# Altium schematic sheet MUX.SchDoc: AUDIO-MUX
size A4; SheetNumber: 3; SheetTotal: 3; DOC_NO_SCH_DWG: #0112023010802
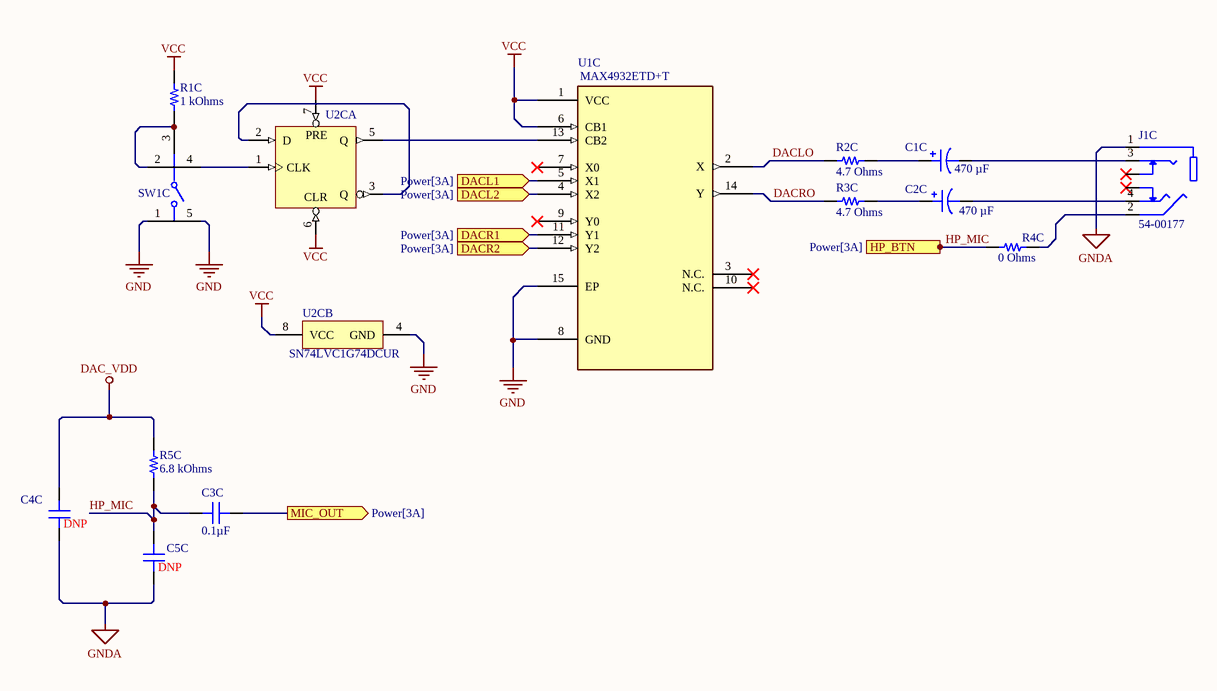
[diagram p0: MUX.SchDoc]

## Parts
C1C  470 µF  [CAP ALSMD POLY 8.3MM H10.0MM]
C2C  470 µF  [CAP ALSMD POLY 8.3MM H10.0MM]
C3C  0.1µF  [CAP 0603_1608]
C4C  DNP  [CAP 0603_1608]
C5C  DNP  [CAP 0603_1608]
J1C  54-00177  [TENSILITY_54-00177]
R1C  1 kOhms  [RES 0603_1608]
R2C  4.7 Ohms  [RES 0603_1608]
R3C  4.7 Ohms  [RES 0603_1608]
R4C  0 Ohms  [RES 0402_1005]
R5C  6.8 kOhms  [RES 0603_1608]
SW1C  KMS231GPLFS  [FP-KMS231GPLFS-MFG]  (value not drawn)
U1C  MAX4932ETD+T  [21-0137_T1433+2_MXM]  (value not drawn)
U2C  SN74LVC1G74DCUR  [DCU0008A_L]  (value not drawn)  (parts A,B of 2)

## Ports
DACL1 (in, see Power[3A]), DACL2 (in, see Power[3A]), DACR1 (in, see Power[3A]), DACR2 (in, see Power[3A]), HP_BTN (out, see Power[3A]), MIC_OUT (out, see Power[3A])

## Nets
DAC_VDD: C4C.1 R5C.2
GND: SW1C.1 SW1C.5 U1C.8(GND) U1C.15(EP) U2C.4(GND)
GNDA: C4C.2 C5C.2 J1C.1
VCC: R1C.2 U1C.1(VCC) U1C.6(CB1) U2C.6(~{CLR}) U2C.7(~{PRE}) U2C.8(VCC)
DACL1: U1C.5(X1) ; port DACL1
DACL2: U1C.4(X2) ; port DACL2
DACLO: R2C.1 U1C.2(X)
DACR1: U1C.11(Y1) ; port DACR1
DACR2: U1C.12(Y2) ; port DACR2
DACRO: R3C.1 U1C.14(Y)
HP_MIC: C3C.2 C5C.1 R4C.1 R5C.1 ; port HP_BTN
MIC_OUT: C3C.1 ; port MIC_OUT
NetC1C_1: C1C.1 R2C.2
NetC1C_2: C1C.2 J1C.3
NetC2C_1: C2C.1 R3C.2
NetC2C_2: C2C.2 J1C.4
NetJ1C_2: J1C.2 R4C.2
NetR1C_1: R1C.1 SW1C.2 SW1C.3
NetSW1C_4: SW1C.4 U2C.1(CLK)
NetU1C_13: U1C.13(CB2) U2C.5(Q)
NetU2C_2: U2C.2(D) U2C.3(Q)

Not connected (* = marked no-connect by the designer): J1C 5* 6*; U1C 3(N.C.)* 7(X0)* 9(Y0)* 10(N.C.)*

## Notes on the sheet
- THIS DOCUMENT AND THE DATA DISCLOSED HEREIN OR
- HEREWITH IS THE PROPERTY OF SPD Ind.
- ENG:
- DHARAGESWARAN S
- APPROVALS
- DATE
- PROJECT
- DSN:
- CHK:
- REFERENCE DOCUMENTS
- PROJECT REVISION:
- TITLE
- DOCUMENT REVISION:
- Email: sdhamuvkl@gmail.com <https://github.com/DhamuVkl>
- BOM:
- FAB DWG:
- PCB DWG:
- ASSY DWG:
- SCALE:
- A4
- SIZE
- CAGE CODE
- FILE NAME
- DWG NO.
- SHEET
- REV
- OF
- (in symbol CMP-0859-00701-3, part A) PRE; CLR

## Library data of the parts
C1C C2C = SVZ1AM471F9RE00RAXXX: POLYMER ALUMINUM SMT; Manufacturer: Aishi Capacitors (Hunan Aihua Group; id: 968; Surface Mount Land Size: 0.327" L x 0.327" W (8.30mm x 8.30mm); Tolerance: ±20%; Voltage - Rated: 10 V; Lifetime @ Temp.: 2000 Hrs @ 105°C; Ripple Current @ High Frequency: 3.4 A @ 100 kHz; Esr (Equivalent Series Resistance): 22mOhm; Part Number: SVZ1AM471F9RE00RAXXX; Value: 470 µF; Height - Seated (Max): 0.394" (10.00mm); Supplier Part Number 1: 3222-SVZ1AM471F9RE00RAXXXCT-ND; ComponentLink2Description: DigiKey Link; PartId: 5392; Supplier 1: DigiKey; Series: VZ; LastUpdated: 2023-01-02T21:05:51.287; Part Status: Active; Type: Polymer; Capacitance: 470 µF; Minimum Order: 1; Packaging: TapeAndReel; Applications: General Purpose; Price: 0.22; ComponentLink2URL: https://www.digikey.com/en/products/detail/aishi-capacitors/SVZ1AM471F9RE00RAXXX/16536381; Lifecycle Status: Active; Operating Temperature: -55°C ~ 105°C; Size / Dimension: 0.315" Dia (8.00mm); Mounting Type: Surface Mount
C3C = LD03ZC104KAB2A: CAP CER 0.1UF 10V X7R 0603; Manufacturer: AVX Corporation; id: 3762; Tolerance: ±10%; Part Number: LD03ZC104KAB2A; Value: 0.1µF; Temperature Coefficient: X7R; Supplier Part Number 1: 478-12926-1-ND; ComponentLink2Description: DigiKey Link; ComponentLink1URL: http://datasheets.avx.com/LD-Series.pdf; PartId: 16481; Supplier 1: DigiKey; Series: LD; LastUpdated: 2020-09-02T01:03:06.140; Part Status: Active; Capacitance: 0.1µF; Device Package: 0603 (1608 Metric); Thickness (Max): 0.035" (0.90mm); Voltage - Rated: 10V; Minimum Order: 1; Packaging: TapeAndReel; Applications: General Purpose; Package / Case: 0603 (1608 Metric); ComponentLink1Description: Datasheet; Price: 0.17; ComponentLink2URL: http://digikey.com/product-detail/en/avx-corporation/LD03ZC104KAB2A/478-12926-1-ND/9949296; Lifecycle Status: Active; Operating Temperature: -55°C ~ 125°C; Size / Dimension: 0.063" L x 0.032" W (1.60mm x 0.81mm); Mounting Type: Surface Mount, MLCC
C4C C5C = LD03ZC104KAB2A: CAP CER 0.1UF 10V X7R 0603; Manufacturer: AVX Corporation; id: 3762; Value: 0.1µF; Tolerance: ±10%; Part Number: LD03ZC104KAB2A; Temperature Coefficient: X7R; Supplier Part Number 1: 478-12926-1-ND; ComponentLink2Description: DigiKey Link; ComponentLink1URL: http://datasheets.avx.com/LD-Series.pdf; PartId: 16481; Supplier 1: DigiKey; Series: LD; LastUpdated: 2020-09-02T01:03:06.140; Part Status: Active; Capacitance: 0.1µF; Device Package: 0603 (1608 Metric); Thickness (Max): 0.035" (0.90mm); Voltage - Rated: 10V; Minimum Order: 1; Packaging: TapeAndReel; Applications: General Purpose; Package / Case: 0603 (1608 Metric); ComponentLink1Description: Datasheet; Price: 0.17; ComponentLink2URL: http://digikey.com/product-detail/en/avx-corporation/LD03ZC104KAB2A/478-12926-1-ND/9949296; Lifecycle Status: Active; Operating Temperature: -55°C ~ 125°C; Size / Dimension: 0.063" L x 0.032" W (1.60mm x 0.81mm); Mounting Type: Surface Mount, MLCC
J1C = 54-00177: Connector, 4C audio jack, 3.5xL14 mm, SMT mount, gold plated; MF: Tensility International Corp; Package: None; Price: None; Check_prices: https://www.snapeda.com/parts/54-00177/Tensility+International+Corp/view-part/?ref=eda; Value: *; SnapEDA_Link: https://www.snapeda.com/parts/54-00177/Tensility+International+Corp/view-part/?ref=snap; MP: 54-00177; Availability: In Stock; Purchase-URL: https://pricing.snapeda.com/search?q=54-00177&ref=eda
R1C = RT0603FRE131KL: CHIP RESISTOR THIN FLIM HIGH PRE; Manufacturer: Yageo; id: 16662; Temperature Coefficient: ±50ppm/°C; Tolerance: ±1%; Power (Watts): 0.1W, 1/10W; Part Number: RT0603FRE131KL; Height - Seated (Max): 0.022" (0.55mm); Supplier Part Number 1: 13-RT0603FRE131KLCT-ND; Supplier Device Package: 0603; ComponentLink1Description: Datasheet; ComponentLink2URL: https://www.digikey.com/en/products/detail/yageo/RT0603FRE131KL/14008371; ComponentLink1URL: https://www.yageo.com/upload/media/product/productsearch/datasheet/rchip/PYu-RT_1-to-0.01_RoHS_L_12.pdf; Composition: Thin Film; Supplier 1: DigiKey; Series: RT; Part Status: Active; ComponentLink2Description: DigiKey Link; Device Package: 0603 (1608 Metric); Packaging: TapeAndReel; Minimum Order: 1; Package / Case: 0603 (1608 Metric); PartId: 67562; Lifecycle Status: Active; LastUpdated: 2023-01-02T20:27:55.493; Operating Temperature: -55°C ~ 155°C; Number Of Terminations: 2; Value: 1 kOhms; Size / Dimension: 0.063" L x 0.031" W (1.60mm x 0.80mm); Price: 0.01; Resistance: 1 kOhms
R2C R3C = SG73P1JTTD4R70F: RES 4.7 OHM 1% 1/3W 0603; Manufacturer: KOA Speer Electronics, Inc.; id: 16524; Temperature Coefficient: ±100ppm/°C; Power (Watts): 0.333W, 1/3W; Part Number: SG73P1JTTD4R70F; Height - Seated (Max): 0.022" (0.55mm); Supplier Part Number 1: 2019-SG73P1JTTD4R70FCT-ND; Supplier Device Package: 0603; ComponentLink1Description: Datasheet; ComponentLink2URL: https://www.digikey.com/en/products/detail/koa-speer-electronics-inc/SG73P1JTTD4R70F/10188387; Features: Automotive AEC-Q200, Pulse Withstanding; ComponentLink1URL: https://www.koaspeer.com/pdfs/SG73P.pdf; Composition: Thick Film; Tolerance: ±1%; Supplier 1: DigiKey; Series: SG73P; Part Status: Active; ComponentLink2Description: DigiKey Link; Device Package: 0603 (1608 Metric); Packaging: TapeAndReel; Ratings: AEC-Q200; Minimum Order: 1; Package / Case: 0603 (1608 Metric); PartId: 66982; Lifecycle Status: Active; LastUpdated: 2023-01-02T20:27:57.163; Operating Temperature: -55°C ~ 155°C; Number Of Terminations: 2; Value: 4.7 Ohms; Size / Dimension: 0.063" L x 0.031" W (1.60mm x 0.80mm); Price: 0.01; Resistance: 4.7 Ohms
R4C = AC0402JR-070RL: RES SMD 0 OHM JUMPER 1/16W 0402; Manufacturer: Yageo; id: 9339; Power (Watts): 0.063W, 1/16W; Part Number: AC0402JR-070RL; Height - Seated (Max): 0.015" (0.37mm); Supplier Part Number 1: 311-0.0LBCT-ND; Supplier Device Package: 0402; ComponentLink1Description: Datasheet; ComponentLink2URL: https://www.digikey.com/en/products/detail/yageo/AC0402JR-070RL/2827807; Features: Automotive AEC-Q200, Moisture Resistant; ComponentLink1URL: https://www.yageo.com/upload/media/product/productsearch/datasheet/rchip/PYu-AC_51_RoHS_L_7.pdf; Composition: Thick Film; Tolerance: Jumper; Supplier 1: DigiKey; Series: AC; Part Status: Active; ComponentLink2Description: DigiKey Link; Device Package: 0402 (1005 Metric); Packaging: CutTape; Ratings: AEC-Q200; Minimum Order: 1; Package / Case: 0402 (1005 Metric); PartId: 20617; Lifecycle Status: Active; LastUpdated: 2023-01-02T20:20:32.243; Operating Temperature: -55°C ~ 155°C; Number Of Terminations: 2; Value: 0 Ohms; Size / Dimension: 0.039" L x 0.020" W (1.00mm x 0.50mm); Price: 0.01; Resistance: 0 Ohms
R5C = ERA-3AEB682V: RES SMD 6.8K OHM 0.1% 1/10W 0603; Manufacturer: Panasonic Electronic Components; id: 311; Temperature Coefficient: ±25ppm/°C; Power (Watts): 0.1W, 1/10W; Part Number: ERA-3AEB682V; Height - Seated (Max): 0.022" (0.55mm); Supplier Part Number 1: P6.8KDBCT-ND; Supplier Device Package: 0603; ComponentLink1Description: Datasheet; ComponentLink2URL: https://www.digikey.com/en/products/detail/panasonic-electronic-components/ERA-3AEB682V/1465874; Features: Automotive AEC-Q200; ComponentLink1URL: https://industrial.panasonic.com/cdbs/www-data/pdf/RDM0000/AOA0000C307.pdf; Composition: Thin Film; Tolerance: ±0.1%; Supplier 1: DigiKey; Series: ERA-3A; Part Status: Active; ComponentLink2Description: DigiKey Link; Device Package: 0603 (1608 Metric); Packaging: TapeAndReel; Ratings: AEC-Q200; Minimum Order: 1; Package / Case: 0603 (1608 Metric); PartId: 5530; Lifecycle Status: Active; LastUpdated: 2023-01-02T20:30:24.413; Operating Temperature: -55°C ~ 155°C; Number Of Terminations: 2; Value: 6.8 kOhms; Size / Dimension: 0.063" L x 0.031" W (1.60mm x 0.80mm); Price: 0.04; Resistance: 6.8 kOhms
SW1C = CMP-10040-000026-1: SWITCH TACTILE SPST-NO 0.05A 50V; Contact Current Rating: 50mA; Max Voltage Rating (DC): 32V; Switch Travel: 0.3mm; Illumination Type: Illuminated; Power Rating: 1W; Operating Force: 3N; Switch Function: Off-Mom; Ratings: IP40; Actuator Length: 0.75mm; Mechanical Life: 100000Cycles; Throw Configuration: SPST; Min Operating Temperature: -40°C; Orientation: Right Angle; Radiation Hardening: No; Mount: Surface Mount; Max Current Rating: 50mA; Packaging: Tape and Reel; Width: 1.42mm; Depth: 4.6mm; Termination: Gull Wing; Contact Plating: Silver; Lead Free: Lead Free; Max Operating Temperature: 85°C; Length: 3.55mm; Current Rating: 50mA; Voltage Rating (DC): 32V; Package Quantity: 1; Contact Material: Silver
U1C = MAX4932ETD+T: No Description Available; Mfr_Name: Analog Devices Inc; RefDes: RefDes; Type: Type; Supplier 1: Mouser; Supplier Part Number 1: 700-MAX4932ETDT
U2C = CMP-0859-00701-3: Single Positive-Edge-Triggered D-Type Flip-Flop With Clear and Preset, DCU0008A, LARGE T&R; Manufacturer: Texas Instruments; Rating: Catalog; Technology Family: LVC; Output Type: CMOS; VCC(Max)(V): 5.5; ICC @ Nom Voltage(Max)(mA): 0.01; Output Drive (IOL/IOH)(Max)(mA): 32/-32; 3-State Output: No; VCC(Min)(V): 1.65; Input Type: CMOS/TTL; Logic: True; Bits(#): 1; Voltage(Nom)(V): 1.8,2.5,3.3,5; tpd @ Nom Voltage(Max)(ns): 13.4,7.1,5.9,4.1; F @ Nom Voltage(Max)(Mhz): 150; PackageReference: DCU0008A; Sub-Family: D-Type Flip-Flop; Schmitt Trigger: No; DatasheetVersion: SCES794E; Generic Part Number: SN74LVC1G74; Operating Temperature Range(C): -40 to 125